# Altium schematic sheet Receiver.SchDoc
size A3
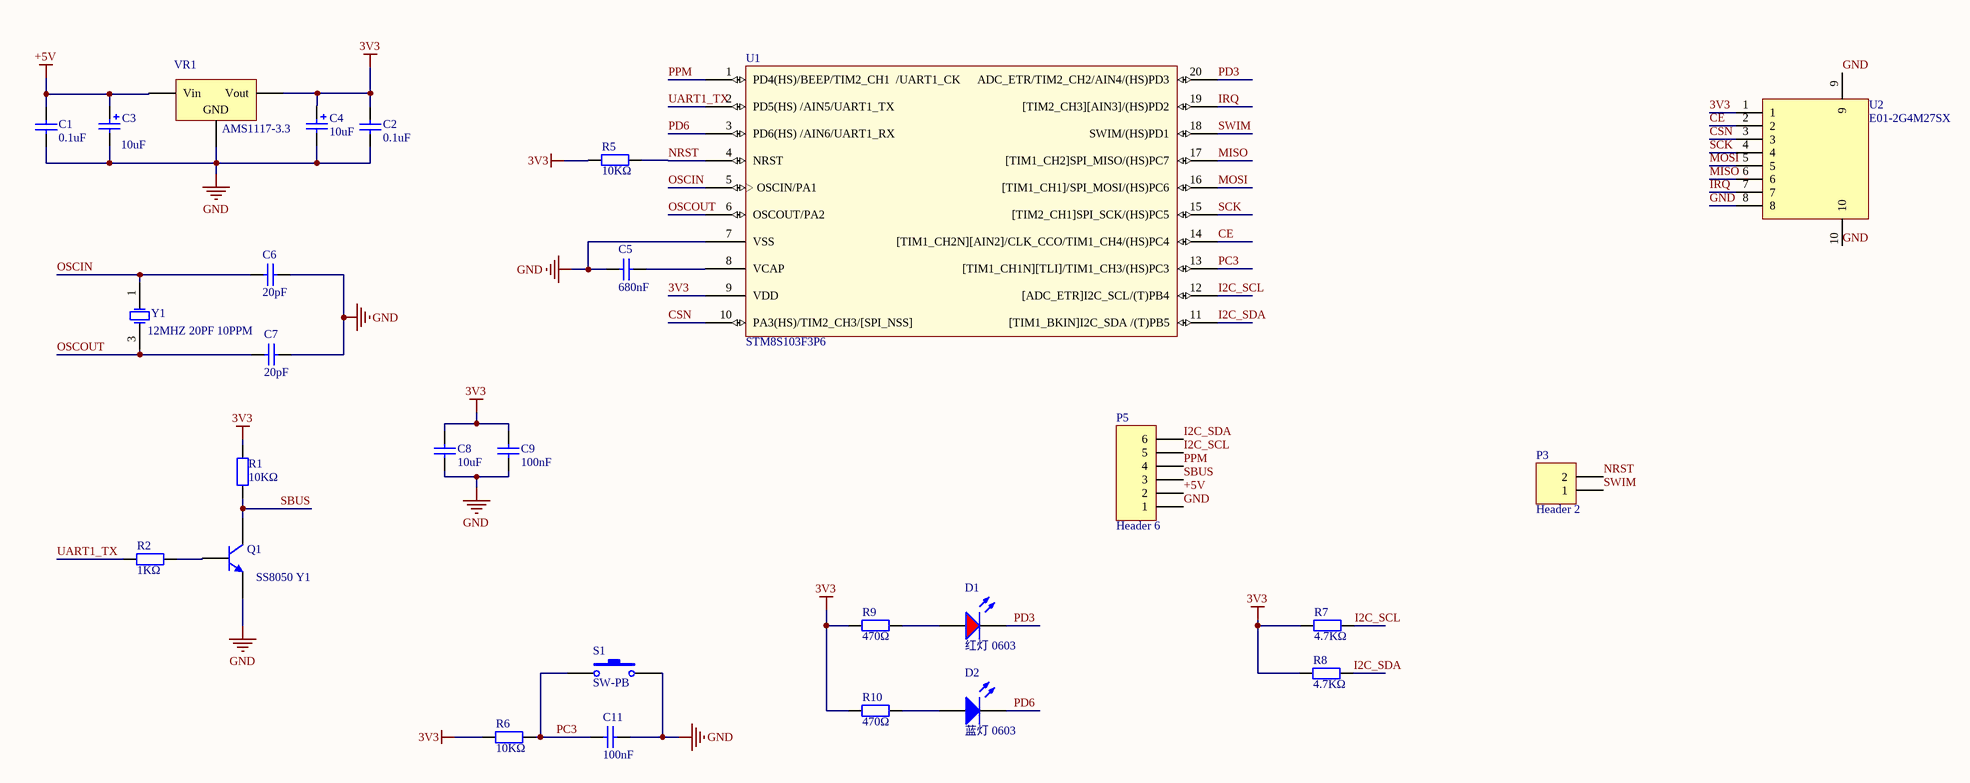
[diagram p0: Receiver.SchDoc]

## Parts
C1  0.1uF  [0603_C]
C2  0.1uF  [0603_C]
C3  10uF  [CASE-A_3216]
C4  10uF  [CASE-A_3216]
C5  680nF  [0603_C]
C6  20pF  [0603_C]
C7  20pF  [0603_C]
C8  10uF  [0603_C]
C9  100nF  [0603_C]
C11  100nF  [0603_C]
D1  红灯 0603  [0603_LED_S1]
D2  蓝灯 0603  [0603_LED_S1]
P3  Header 2  [HDR1X2]
P5  Header 6  [HDR1X6]
Q1  SS8050 Y1  [SOT-23(SOT-23-3)]
R1  10KΩ  [0603_R]
R2  1KΩ  [0603_R]
R5  10KΩ  [0603_R]
R6  10KΩ  [0603_R]
R7  4.7KΩ  [0603_R]
R8  4.7KΩ  [0603_R]
R9  470Ω  [0603_R]
R10  470Ω  [0603_R]
S1  SW-PB  [SMD_KEY_4P]
U1  STM8S103F3P6  [TSSOP-20]
U2  E01-2G4M27SX  [E01-2G4M27SX]
VR1  AMS1117-3.3  [SOT-223]
Y1  12MHZ 20PF 10PPM  [SMD-3225_4P]

## Nets
3V3: C2.2 C4.1 C8.2 C9.2 R1.2 R5.2 R6.2 R7.1 R8.1 R9.1 R10.1 U1.9(VDD) U2.1 VR1.2(Vout)
+5V: C1.2 C3.1 P5.2 VR1.3(Vin)
GND: C1.1 C2.1 C3.2 C4.2 C5.2 C6.2 C7.1 C8.1 C9.1 C11.1 P5.1 Q1.2(E) S1.2 U1.7(VSS) U2.8 U2.9 U2.10 VR1.1(GND)
CE: U1.14([TIM1_CH2N][AIN2]/CLK_CCO/TIM1_CH4/(HS)PC4) U2.2
CSN: U1.10(PA3(HS)/TIM2_CH3/[SPI_NSS]) U2.3
I2C_SCL: P5.5 R7.2 U1.12([ADC_ETR]I2C_SCL/(T)PB4)
I2C_SDA: P5.6 R8.2 U1.11([TIM1_BKIN]I2C_SDA_/(T)PB5)
IRQ: U1.19([TIM2_CH3][AIN3]/(HS)PD2) U2.7
MISO: U1.17([TIM1_CH2]SPI_MISO/(HS)PC7) U2.6
MOSI: U1.16([TIM1_CH1]/SPI_MOSI/(HS)PC6) U2.5
NRST: P3.2 R5.1 U1.4(NRST)
OSCIN: C6.1 U1.5(OSCIN/PA1) Y1.1(OSC1)
OSCOUT: C7.2 U1.6(OSCOUT/PA2) Y1.3(OSC2)
PC3: C11.2 R6.1 S1.1 U1.13([TIM1_CH1N][TLI]/TIM1_CH3/(HS)PC3)
PD3: D1.K U1.20(ADC_ETR/TIM2_CH2/AIN4/(HS)PD3)
PD6: D2.K U1.3(PD6(HS)_/AIN6/UART1_RX)
PPM: P5.4 U1.1(PD4(HS)/BEEP/TIM2_CH1__/UART1_CK)
SBUS: P5.3 Q1.3(C) R1.1
SCK: U1.15([TIM2_CH1]SPI_SCK/(HS)PC5) U2.4
SWIM: P3.1 U1.18(SWIM/(HS)PD1)
UART1_TX: R2.1 U1.2(PD5(HS)_/AIN5/UART1_TX)
NetC5_1: C5.1 U1.8(VCAP)
NetD1_A: D1.A R9.2
NetD2_A: D2.A R10.2
NetQ1_1: Q1.1(B) R2.2

## Library data of the parts
C1 C2 C5 C8 C9 C11 = 0603 1uF (105) 10% 50V: 贴片电容; ComponentLink1Description: 供应商链接; ComponentLink1URL: http://www.szlcsc.com/product/details_16531.html; Package: 0603; Supplier: LC; SuppliersPartNumber: C15849
C3 C4 = 3216 10uF (106) 10% 16V: 钽电容; ComponentLink1Description: 供应商链接; ComponentLink1URL: http://www.szlcsc.com/product/details_7643.html; Package: 3216; Supplier: LC; SuppliersPartNumber: C7171
C6 C7 = 0603 1.0pF (010) 0.25pF 50V: 贴片电容; ComponentLink1Description: 供应商链接; ComponentLink1URL: http://www.szlcsc.com/product/details_24709.html; Package: 0603; Supplier: LC; SuppliersPartNumber: C23969
D1 = 0603 红灯: 发光二极管; ComponentLink1Description: 供应商链接; ComponentLink1URL: http://www.szlcsc.com/product/details_2659.html; Package: 0603; Supplier: LC; SuppliersPartNumber: C2286
D2 = 0603 蓝灯: 发光二极管; ComponentLink1Description: 供应商链接; ComponentLink1URL: http://www.szlcsc.com/product/details_73150.html; Package: 0603; Supplier: LC; SuppliersPartNumber: C72041
P3 = Header 2: Header, 2-Pin; LatestRevisionDate: 17-Jul-2002; LatestRevisionNote: Re-released for DXP Platform.; Publisher: Altium Limited
P5 = Header 6: Header, 6-Pin; LatestRevisionDate: 17-Jul-2002; LatestRevisionNote: Re-released for DXP Platform.; Publisher: Altium Limited
Q1 = SOT-23 SS8050 Y1: 三极管; ComponentLink1Description: 供应商链接; ComponentLink1URL: http://www.szlcsc.com/product/details_2507.html; Package: SOT-23; Supplier: LC; SuppliersPartNumber: C2150
R1 R2 R5 R6 = 0603 1KΩ (1001) 1%: 贴片电阻; ComponentLink1Description: 供应商链接; ComponentLink1URL: http://www.szlcsc.com/product/details_21904.html; Package: 0603; Supplier: LC; SuppliersPartNumber: C21190
R7 R8 = 0603 1.5KΩ (1501) 1%: 贴片电阻; ComponentLink1Description: 供应商链接; ComponentLink1URL: http://www.szlcsc.com/product/details_23570.html; Package: 0603; Supplier: LC; SuppliersPartNumber: C22843
R9 R10 = 0603 1.1KΩ (1101) 1%: 贴片电阻; ComponentLink1Description: 供应商链接; ComponentLink1URL: http://www.szlcsc.com/product/details_23491.html; Package: 0603; Supplier: LC; SuppliersPartNumber: C22764
S1 = SW-PB: Switch; Published: 24-Mar-1999; LatestRevisionDate: 17-Jul-2002; LatestRevisionNote: Re-released for DXP Platform.; PackageReference: SPST-2; Publisher: Altium Limited; PackageDescription: Switch; 2 Leads
U1 = STM8S103F3P6: MCU; ComponentLink1Description: 供应商链接; ComponentLink1URL: http://www.szlcsc.com/product/details_56989.html; Package: TSSOP-20; Supplier: LC; SuppliersPartNumber: C55961
VR1 = SOT-223 AMS1117-3.3: 低压差线性稳压(LDO); ComponentLink1Description: 供应商链接; ComponentLink1URL: http://www.szlcsc.com/product/details_6652.html; Package: SOT-223; Supplier: LC; SuppliersPartNumber: C6186
Y1 = SMD-3225_4P  12MHZ 20PF 10PPM: 贴片晶振; ComponentLink1Description: 供应商链接; ComponentLink1URL: http://www.szlcsc.com/product/details_9522.html; Package: SMD-3225_4P; Supplier: LC; SuppliersPartNumber: C9002